# Altium schematic sheet USB.SchDoc
size A; SheetNumber: 2; SheetTotal: 3
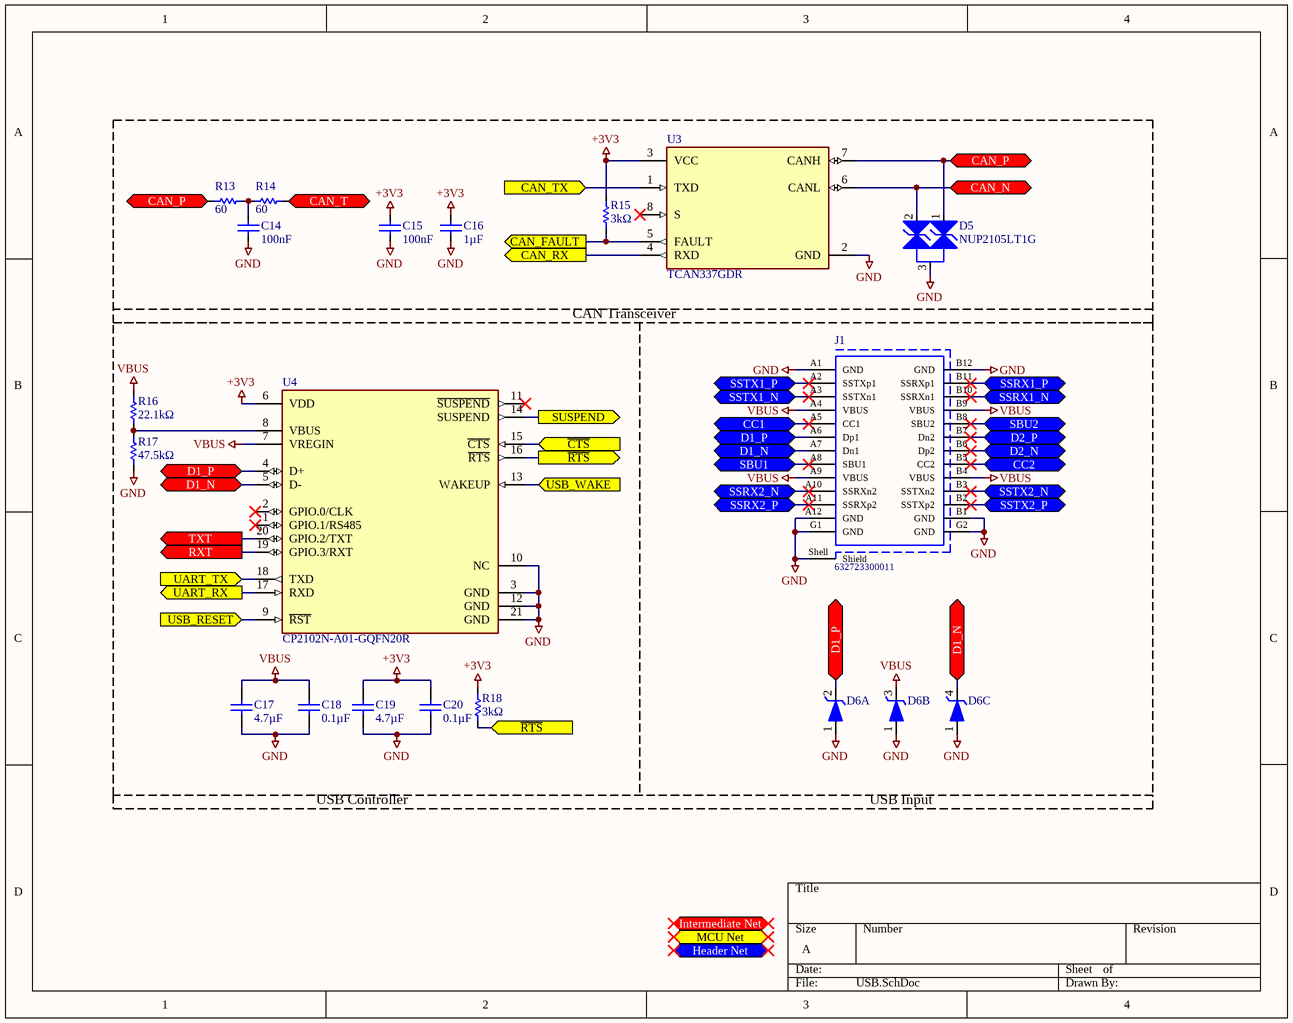
[diagram p0: USB.SchDoc]

## Parts
C14  100nF  [1608[0603]]
C15  100nF  [1608[0603]]
C16  value 1µF  [1608[0603]]  (hidden comment: 100nF)
C17  value 4.7µF  [1608[0603]]  (hidden comment: 100nF)
C18  value 0.1µF  [1608[0603]]  (hidden comment: 100nF)
C19  value 4.7µF  [1608[0603]]  (hidden comment: 100nF)
C20  value 0.1µF  [1608[0603]]  (hidden comment: 100nF)
D5  NUP2105LT1G  [ONSC-SOT-23-3-318-08_V]
D6  SP0503BAHTG  [SOT143]  (value not drawn)  (parts A,B,C of 3)
J1  632723300011  [632723300011]
R13  value 60  [1608[0603]]  (hidden comment: 60 ohm)
R14  value 60  [1608[0603]]  (hidden comment: 60 ohm)
R15  value 3kΩ  [1608[0603]]  (hidden comment: 3k)
R16  value 22.1kΩ  [1608[0603]]  (hidden comment: 3k)
R17  value 47.5kΩ  [1608[0603]]  (hidden comment: 3k)
R18  value 3kΩ  [1608[0603]]  (hidden comment: 3k)
U3  TCAN337GDR  [FP-D0008A-IPC_C]
U4  CP2102N-A01-GQFN20R  [FP-CP2102N-A01-GQFN20R-MFG]

## Blocks framed on the sheet
CAN Transceiver: C14-C16 D5 R13-R15 U3

## Ports
CAN_FAULT (out), CAN_N (bidir), CAN_P (bidir), CAN_RX (out), CAN_T (bidir), CAN_TX (in), CC1 (bidir), CC2 (bidir), D1_N (bidir), D1_P (bidir), D2_N (bidir), D2_P (bidir), Header Net (bidir), Intermediate Net (bidir), MCU Net (bidir), RXT (out), SBU1 (bidir), SBU2 (bidir), SSRX1_N (bidir), SSRX1_P (bidir), SSRX2_N (bidir), SSRX2_P (bidir), SSTX1_N (bidir), SSTX1_P (bidir), SSTX2_N (bidir), SSTX2_P (bidir), SUSPEND (out), TXT (out), UART_RX (out), UART_TX (in), USB_RESET (in), USB_WAKE (in), ~{CTS} (in), ~{RTS} (in), ~{RTS} (out)

## Nets
+3V3: C15.1 C16.1 C19.1 C20.1 R15.1 R18.1 U3.3(VCC) U4.6(VDD)
GND: C14.2 C15.2 C16.2 C17.2 C18.2 C19.2 C20.2 D5.3(K) D6.1 J1.A1(GND) J1.A12(GND) J1.B1(GND) J1.B12(GND) J1.G1(GND) J1.G2(GND) J1.Shell(Shield) R17.2 U3.2(GND) U4.3(GND) U4.10(NC) U4.12(GND) U4.21(GND)
VBUS: C17.1 C18.1 D6.3 J1.A4(VBUS) J1.A9(VBUS) J1.B4(VBUS) J1.B9(VBUS) R16.1 U4.7(VREGIN)
~{CTS}: U4.15(~{CTS}) ; port ~{CTS}
~{RTS}: R18.2 U4.16(~{RTS}) ; port ~{RTS}
CAN_FAULT: R15.2 U3.5(FAULT) ; port CAN_FAULT
CAN_N: D5.2(K) U3.6(CANL) ; port CAN_N
CAN_P: D5.1(K) R13.2 U3.7(CANH) ; port CAN_P
CAN_RX: U3.4(RXD) ; port CAN_RX
CAN_T: R14.1 ; port CAN_T
CAN_TX: U3.1(TXD) ; port CAN_TX
CC1: J1.A5(CC1) ; port CC1
CC2: J1.B5(CC2) ; port CC2
D1_N: D6.4 J1.A7(Dn1) U4.5(D-) ; port D1_N
D1_P: D6.2 J1.A6(Dp1) U4.4(D+) ; port D1_P
D2_N: J1.B6(Dp2) ; port D2_N
D2_P: J1.B7(Dn2) ; port D2_P
RXT: U4.19(GPIO.3/RXT) ; port RXT
SBU1: J1.A8(SBU1) ; port SBU1
SBU2: J1.B8(SBU2) ; port SBU2
SSRX1_N: J1.B10(SSRXn1) ; port SSRX1_N
SSRX1_P: J1.B11(SSRXp1) ; port SSRX1_P
SSRX2_N: J1.A10(SSRXn2) ; port SSRX2_N
SSRX2_P: J1.A11(SSRXp2) ; port SSRX2_P
SSTX1_N: J1.A3(SSTXn1) ; port SSTX1_N
SSTX1_P: J1.A2(SSTXp1) ; port SSTX1_P
SSTX2_N: J1.B3(SSTXn2) ; port SSTX2_N
SSTX2_P: J1.B2(SSTXp2) ; port SSTX2_P
SUSPEND: U4.14(SUSPEND) ; port SUSPEND
TXT: U4.20(GPIO.2/TXT) ; port TXT
UART_RX: U4.17(RXD) ; port UART_RX
UART_TX: U4.18(TXD) ; port UART_TX
USB_RESET: U4.9(~{RST}) ; port USB_RESET
USB_WAKE: U4.13(WAKEUP) ; port USB_WAKE
NetC14_1: C14.1 R13.1 R14.2
NetR16_2: R16.2 R17.1 U4.8(VBUS)

Not connected (* = marked no-connect by the designer): U3 8(S)*; U4 1(GPIO.1/RS485)* 2(GPIO.0/CLK)* 11(~{SUSPEND})*

## Notes on the sheet
- USB Controller
- USB Input

## Library data of the parts
C14-C20 = Cap Semi: Capacitor (Semiconductor SIM Model); Published: 8-Jun-2000; LatestRevisionDate: 29-May-2009; LatestRevisionNote: IPC-7351 Footprint Added.; PackageReference: C1206; Publisher: Altium Limited; PackageDescription: Chip Capacitor
  C14 C15: Value: 100nF
D5 = CMP-1063-00164-1: Dual Line CAN Bus Protector, 3-Pin SOT-23, Pb-Free, Tape and Reel; Manufacturer: On Semiconductor; IR Max (uA): 0.1; Number of Lines: 2; Direction: Bidirectional; C Max (pF): 30; PPK Max (W): 350; V(BR) Min (V): 26.2; ComponentLink3URL: http://www.onsemi.cn/pub_link/Collateral/318-08.PDF; Mounting Technology: Surface Mount; ComponentLink2Description: Datasheet; PartNumber: NUP2105LT1G; ComponentLink1URL: http://www.onsemi.com/; PackageVersion: Rev. AP, 11/2009; DatasheetVersion: Rev. 5; RoHS: Pb-Free; PackageReference: SOT-23-3-318-08; ComponentLink2URL: http://www.onsemi.cn/pub_link/Collateral/NUP2105L-D.PDF; ComponentLink1Description: Manufacturer URL; PackageDescription: 3-Pin Small Outline Transistor, Body 2.92 x 1.3 mm, Pitch 0.95 mm; Packing: Tape and Reel; ComponentLink3Description: Package Specification
D6 = LFUS-SP0503BAHTG-SOT143-4: TVS Diode Array, 30 pF, 30 KV, -40 to 85 degC, 4-Pin SOT143, RoHS, Tape and Reel; Manufacturer: Littelfuse; Direction Type: Uni-Directional; Product Height (mm): 1.05mm; Leakage Current (Max): 0.1uA; Clamping Voltage (Max): 8V; Reverse Stand-off Voltage: 5.5(Min)V; Configuration: Triple; Working Voltage: 5.5V; Product Length (mm): 3.04mm; Working Voltage (Max): 5.5V(Min); Capacitance Value: 30pF; Rad Hardened: No; Number of Elements: 3; Product Depth (mm): 1.4mm; Operating Temperature Max Deg. C: 85C; Suppressor Type: TVS; Operating Temperature Min Deg. C: -40C; Operating Temp Range: -40Cto85C; Mounting: SurfaceMount; Package / Case: SOT-143; Datasheet Version: Dec-13; Package Type: SOT-143; Packaging: TapeandReel; Pin Count: 3+Tab; Operating Temperature Classification: Industrial; Datasheet URL: https://datasheet.ciiva.com/15143/getdatasheetpartid-116020-15143550.pdf; Manufacturer URL: http://www.littelfuse.com/; Leakage Current: 0.1uA; Mounting Style: SurfaceMount; Clamping Voltage: 8V; Polarity: Uni-Directional
J1 = CMP-1502-03214-1: USB 3.1 Type C Receptacle WR-COM, Horizontal, SMT / THT; Manufacturer: Wurth Elektronik; Rated Current: 5A; Contact Resistance: 30mOhm; Working Voltage: 20VDC; Operating Temperature: -40to105degC; Package Reference: 632723300011; Datasheet URL: https://katalog.we-online.de/em/datasheet/632723x00011%282%29.pdf; Manufacturer URL: http://www.we-online.de; Connector Type: USB3.1TypeC; Gender: Receptacle; Part Number: 632723300011; Mounting Technology: SMT/THT; Publisher: WurthElektronik; Packaging: TapeandReel; Orientation: Horizontal
R13-R18 = Res1: Resistor; Published: 8-Jun-2000; LatestRevisionDate: 17-Jul-2002; LatestRevisionNote: Re-released for DXP Platform.; PackageReference: AXIAL-0.3; Publisher: Altium Limited; PackageDescription: Axial Device, Thru-Hole; 2 Leads; 0.3 in Pin Spacing
U3 = CMP-04872-000068-1: IC TRANSCEIVER 1/1 8SOIC; Max Supply Voltage: 3.6V; Min Supply Voltage: 3V; Interface: CAN; REACH SVHC: No SVHC; Case/Package: SOIC; RoHS Compliant: Yes; Packaging: Cut Tape; Max Operating Temperature: 125°C; Number of Pins: 8; Lead Free: Lead Free; Min Operating Temperature: -40°C
U4 = CMP-08093-000003-1: IC BRIDGE USB TO UART 20QFN; Manufacturer: Silicon Labs; Nominal Supply Current: 9.5-13.7mA; Usb Standard: USB 2.0; Standoff Height: 0mm; Min Supply Voltage: 1.71V; Max Supply Voltage: 5.25V; Interface: UART,USB; Data Rate: 3Mbits/s; Number Of Ports: 1; Max Junction Temp: +105°C; Package: CP2102N-A01-GQFN20R; Octopart: https://octopart.com/cp2102n-a01-gqfn20r-silicon+labs-76789142; Height: 0.8mm; Category: IC; Temperature: -40°C to +85°C; Ambient Temperature Range Low: -40°C; ComponentLink2URL: https://www.silabs.com/documents/public/data-sheets/cp2102n-datasheet.pdf; Temperature Range Low: -40°C; RoHS: TRUE; Device Class L2: Interface ICs; Ambient Temperature Range High: +85°C; Device Class L3: USB Interface ICs; Mouser Description: USB to USRT Bridge Controller 20-Pin QFN T/R; Lead Free: Yes; Device Class L1: Integrated Circuits (ICs); Digikey Description: IC BRIDGE USB TO UART 20QFN; Temperature Range High: +85°C; Manufacturer Part Number: CP2102N-A01-GQFN20R; ComponentLink2Description: Datasheet; Automotive: No